# Altium schematic sheet NvideaJetsonUSBPage2.SchDoc
size A3
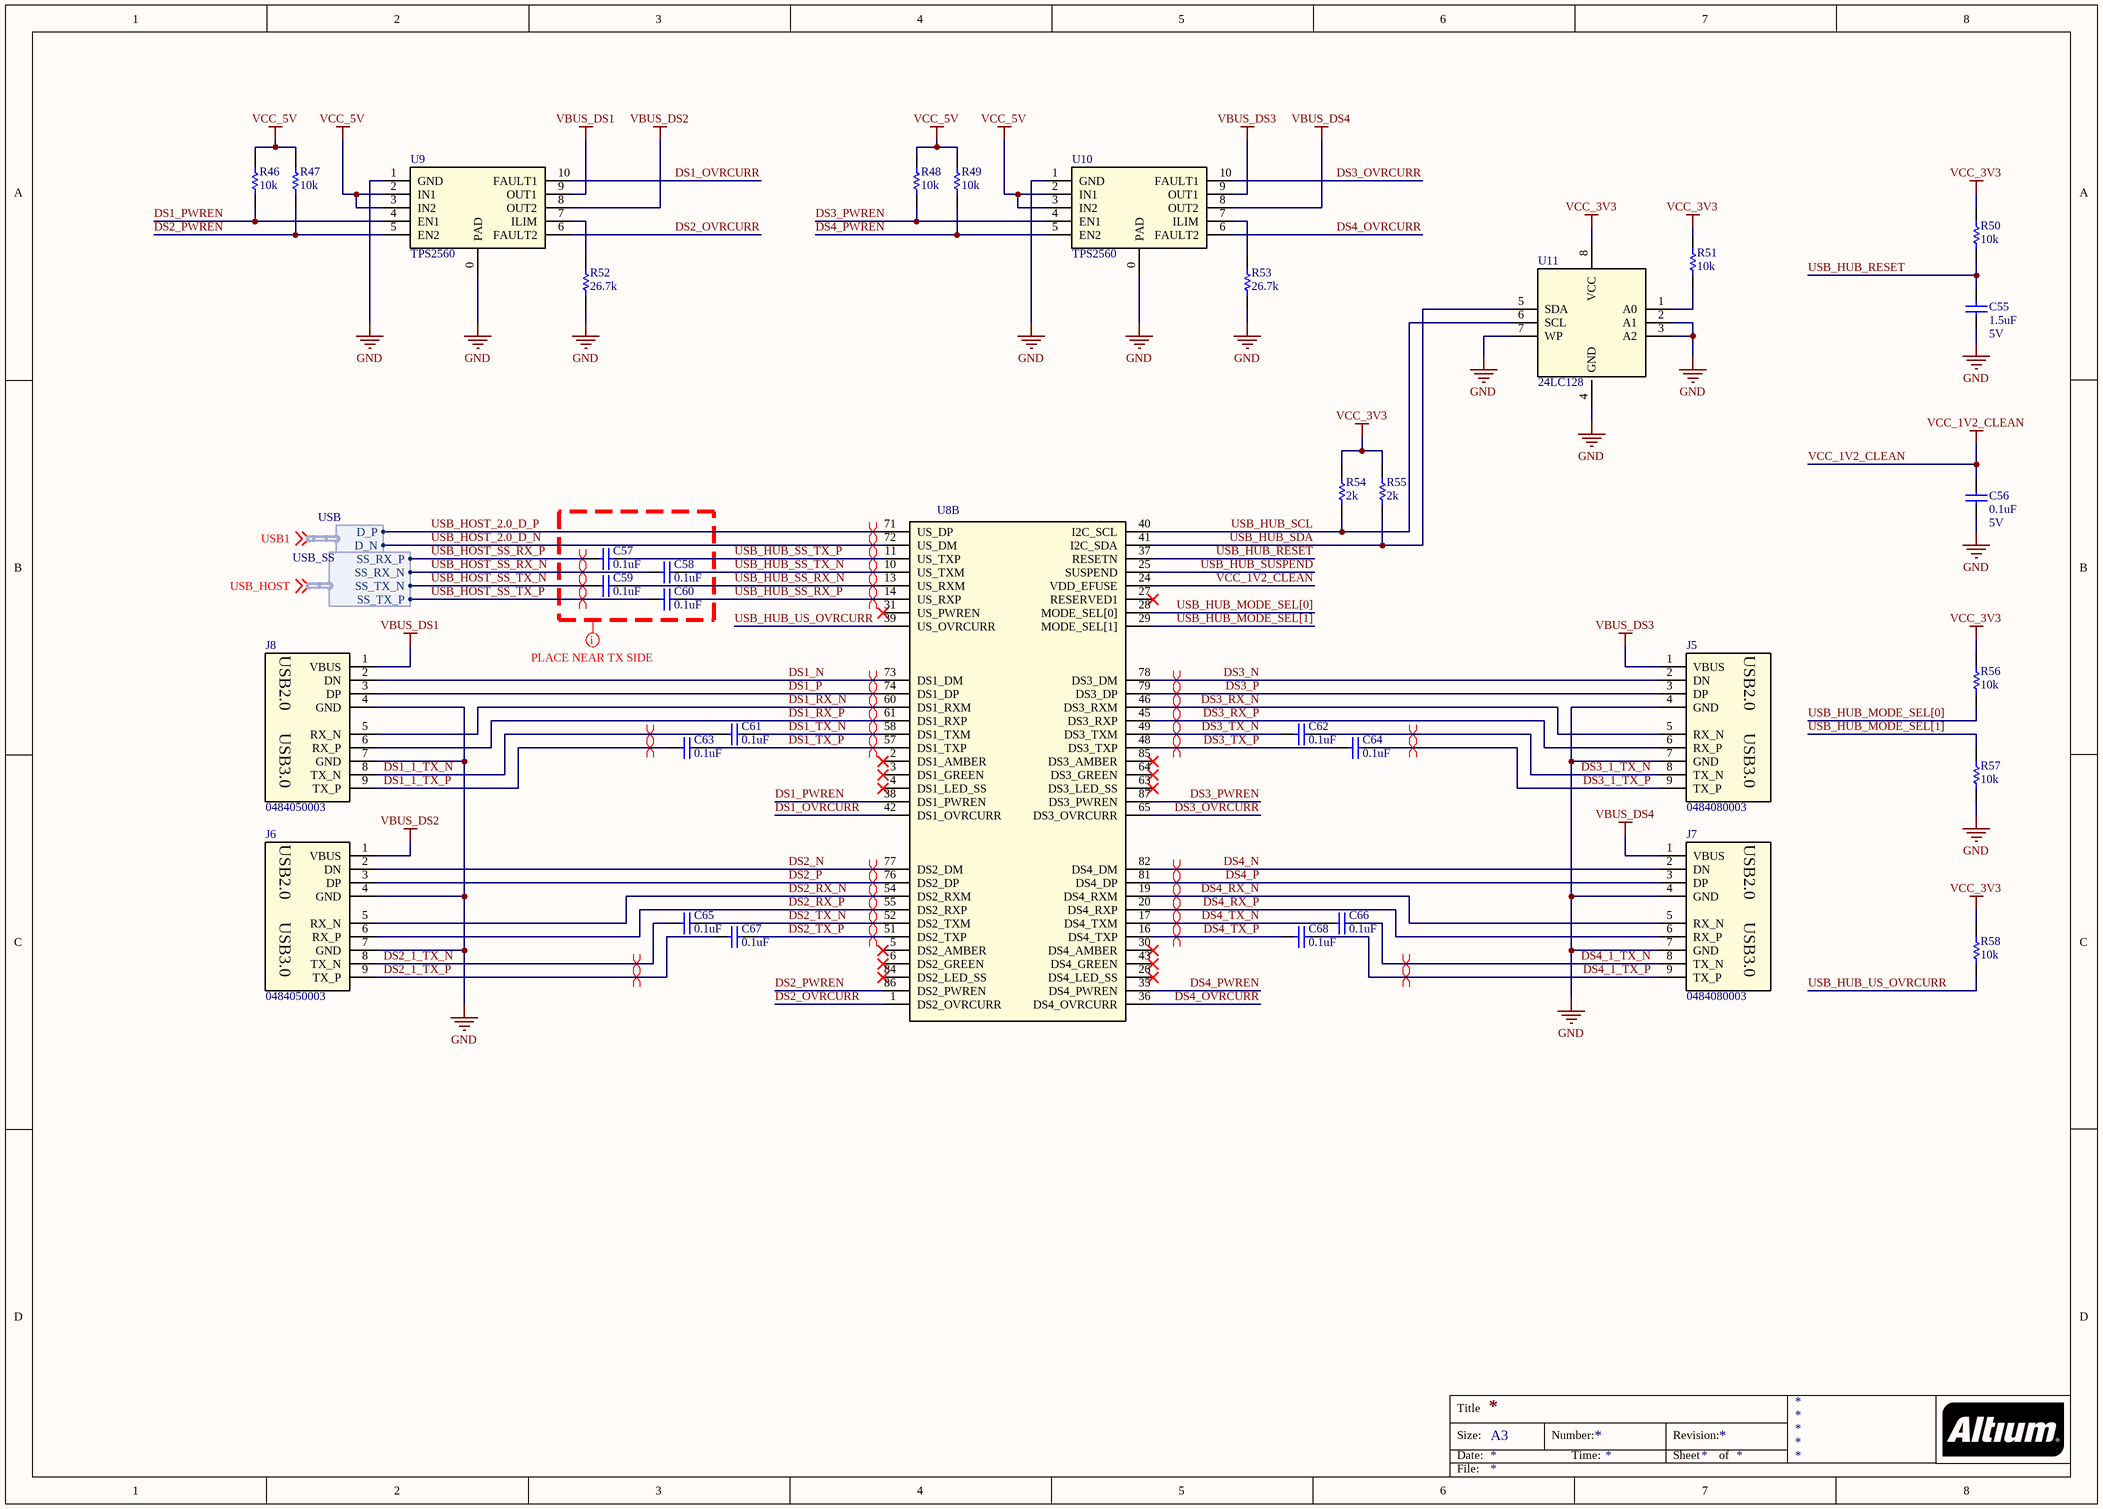
[diagram p0: NvideaJetsonUSBPage2.SchDoc]

## Parts
C55  value 1.5uF  Voltage: 5V  [C0402]  (hidden comment: CAP)
C56  value 0.1uF  Voltage: 5V  [C0402]  (hidden comment: CAP)
C57  value 0.1uF  [C0402]  (hidden comment: CAP)
C58  value 0.1uF  [C0402]  (hidden comment: CAP)
C59  value 0.1uF  [C0402]  (hidden comment: CAP)
C60  value 0.1uF  [C0402]  (hidden comment: CAP)
C61  value 0.1uF  [C0402]  (hidden comment: CAP)
C62  value 0.1uF  [C0402]  (hidden comment: CAP)
C63  value 0.1uF  [C0402]  (hidden comment: CAP)
C64  value 0.1uF  [C0402]  (hidden comment: CAP)
C65  value 0.1uF  [C0402]  (hidden comment: CAP)
C66  value 0.1uF  [C0402]  (hidden comment: CAP)
C67  value 0.1uF  [C0402]  (hidden comment: CAP)
C68  value 0.1uF  [C0402]  (hidden comment: CAP)
J5  0484080003  [0484080003]
J6  0484050003  [0484050003]
J7  0484080003  [0484080003]
J8  0484050003  [0484050003]
R46  value 10k  [R0402]  (hidden comment: RES)
R47  value 10k  [R0402]  (hidden comment: RES)
R48  value 10k  [R0402]  (hidden comment: RES)
R49  value 10k  [R0402]  (hidden comment: RES)
R50  value 10k  [R0402]  (hidden comment: RES)
R51  value 10k  [R0402]  (hidden comment: RES)
R52  value 26.7k  [R0402]  (hidden comment: RES)
R53  value 26.7k  [R0402]  (hidden comment: RES)
R54  value 2k  [R0402]  (hidden comment: RES)
R55  value 2k  [R0402]  (hidden comment: RES)
R56  value 10k  [R0402]  (hidden comment: RES)
R57  value 10k  [R0402]  (hidden comment: RES)
R58  value 10k  [R0402]  (hidden comment: RES)
U8  CYUSB3312-88LTXC  [QFN88]  (value not drawn)  (part B of 2)
U9  TPS2560  [VSON10]
U10  TPS2560  [VSON10]
U11  24LC128  [24LC128T-I/SN]

## Harnesses
USB_SS: SS_RX_P, SS_RX_N, SS_TX_N, SS_TX_P
USB: D_N, D_P

## Nets
GND: C55.2 C56.2 J5.4(GND) J5.7(GND) J6.4(GND) J6.7(GND) J7.4(GND) J7.7(GND) J8.4(GND) J8.7(GND) R52.2 R53.2 R57.2 U9.0(PAD) U9.1(GND) U10.0(PAD) U10.1(GND) U11.2(A1) U11.3(A2) U11.4(GND) U11.7(WP)
VBUS_DS1: J8.1(VBUS) U9.9(OUT1)
VBUS_DS2: J6.1(VBUS) U9.8(OUT2)
VBUS_DS3: J5.1(VBUS) U10.9(OUT1)
VBUS_DS4: J7.1(VBUS) U10.8(OUT2)
VCC_1V2_CLEAN: C56.1 U8.24(VDD_EFUSE)
VCC_3V3: R50.1 R51.1 R54.1 R55.1 R56.1 R58.1 U11.8(VCC)
VCC_5V: R46.1 R47.1 R48.1 R49.1 U9.2(IN1) U9.3(IN2) U10.2(IN1) U10.3(IN2)
DS1_1_TX_N: C61.1 J8.8(TX_N)
DS1_1_TX_P: C63.1 J8.9(TX_P)
DS1_N: J8.2(DN) U8.73(DS1_DM)
DS1_OVRCURR: U8.42(DS1_OVRCURR) U9.10(FAULT1)
DS1_P: J8.3(DP) U8.74(DS1_DP)
DS1_PWREN: R46.2 U8.38(DS1_PWREN) U9.4(EN1)
DS1_RX_N: J8.5(RX_N) U8.60(DS1_RXM)
DS1_RX_P: J8.6(RX_P) U8.61(DS1_RXP)
DS1_TX_N: C61.2 U8.58(DS1_TXM)
DS1_TX_P: C63.2 U8.57(DS1_TXP)
DS2_1_TX_N: C65.1 J6.8(TX_N)
DS2_1_TX_P: C67.1 J6.9(TX_P)
DS2_N: J6.2(DN) U8.77(DS2_DM)
DS2_OVRCURR: U8.1(DS2_OVRCURR) U9.6(FAULT2)
DS2_P: J6.3(DP) U8.76(DS2_DP)
DS2_PWREN: R47.2 U8.86(DS2_PWREN) U9.5(EN2)
DS2_RX_N: J6.5(RX_N) U8.54(DS2_RXM)
DS2_RX_P: J6.6(RX_P) U8.55(DS2_RXP)
DS2_TX_N: C65.2 U8.52(DS2_TXM)
DS2_TX_P: C67.2 U8.51(DS2_TXP)
DS3_1_TX_N: C62.2 J5.8(TX_N)
DS3_1_TX_P: C64.2 J5.9(TX_P)
DS3_N: J5.2(DN) U8.78(DS3_DM)
DS3_OVRCURR: U8.65(DS3_OVRCURR) U10.10(FAULT1)
DS3_P: J5.3(DP) U8.79(DS3_DP)
DS3_PWREN: R48.2 U8.87(DS3_PWREN) U10.4(EN1)
DS3_RX_N: J5.5(RX_N) U8.46(DS3_RXM)
DS3_RX_P: J5.6(RX_P) U8.45(DS3_RXP)
DS3_TX_N: C62.1 U8.49(DS3_TXM)
DS3_TX_P: C64.1 U8.48(DS3_TXP)
DS4_1_TX_N: C66.2 J7.8(TX_N)
DS4_1_TX_P: C68.2 J7.9(TX_P)
DS4_N: J7.2(DN) U8.82(DS4_DM)
DS4_OVRCURR: U8.36(DS4_OVRCURR) U10.6(FAULT2)
DS4_P: J7.3(DP) U8.81(DS4_DP)
DS4_PWREN: R49.2 U8.35(DS4_PWREN) U10.5(EN2)
DS4_RX_N: J7.5(RX_N) U8.19(DS4_RXM)
DS4_RX_P: J7.6(RX_P) U8.20(DS4_RXP)
DS4_TX_N: C66.1 U8.17(DS4_TXM)
DS4_TX_P: C68.1 U8.16(DS4_TXP)
USB_HOST_2.0_D_N: U8.72(US_DM) ; harness USB.D_N
USB_HOST_2.0_D_P: U8.71(US_DP) ; harness USB.D_P
USB_HOST_SS_RX_N: C58.1 ; harness USB_SS.SS_RX_N
USB_HOST_SS_RX_P: C57.1 ; harness USB_SS.SS_RX_P
USB_HOST_SS_TX_N: C59.1 ; harness USB_SS.SS_TX_N
USB_HOST_SS_TX_P: C60.1 ; harness USB_SS.SS_TX_P
USB_HUB_MODE_SEL[0]: R56.2 U8.28(MODE_SEL[0])
USB_HUB_MODE_SEL[1]: R57.1 U8.29(MODE_SEL[1])
USB_HUB_RESET: C55.1 R50.2 U8.37(RESETN)
USB_HUB_SCL: R54.2 U8.40(I2C_SCL) U11.6(SCL)
USB_HUB_SDA: R55.2 U8.41(I2C_SDA) U11.5(SDA)
USB_HUB_SS_RX_N: C59.2 U8.13(US_RXM)
USB_HUB_SS_RX_P: C60.2 U8.14(US_RXP)
USB_HUB_SS_TX_N: C58.2 U8.10(US_TXM)
USB_HUB_SS_TX_P: C57.2 U8.11(US_TXP)
USB_HUB_SUSPEND: U8.25(SUSPEND)
USB_HUB_US_OVRCURR: R58.2 U8.39(US_OVRCURR)
NetR51_2: R51.2 U11.1(A0)
NetR52_1: R52.1 U9.7(ILIM)
NetR53_1: R53.1 U10.7(ILIM)

Not connected (* = marked no-connect by the designer): U8 2(DS1_AMBER)* 3(DS1_GREEN)* 4(DS1_LED_SS)* 5(DS2_AMBER)* 6(DS2_GREEN)* 26(DS4_LED_SS)* 27(RESERVED1)* 30(DS4_AMBER)* 31(US_PWREN)* 43(DS4_GREEN)* 63(DS3_LED_SS)* 64(DS3_GREEN)* 84(DS2_LED_SS)* 85(DS3_AMBER)*

## Layout directives
mark named PLACE NEAR TX SIDE: (no net found under the mark)
differential pair; differential pair class DIFF; net class USB: DS1_1_TX_N, DS1_1_TX_P, DS1_N, DS1_P, DS1_RX_N, DS1_RX_P, DS1_TX_N, DS1_TX_P, DS2_1_TX_N, DS2_1_TX_P, DS2_N, DS2_P, DS2_RX_N, DS2_RX_P, DS2_TX_N, DS2_TX_P, DS3_1_TX_N, DS3_1_TX_P, DS3_N, DS3_P, DS3_RX_N, DS3_RX_P, DS3_TX_N, DS3_TX_P, DS4_1_TX_N, DS4_1_TX_P, DS4_N, DS4_P, DS4_RX_N, DS4_RX_P, DS4_TX_N, DS4_TX_P, USB_HOST_2.0_D_N, USB_HOST_2.0_D_P, USB_HOST_SS_RX_N, USB_HOST_SS_RX_P, USB_HOST_SS_TX_N, USB_HOST_SS_TX_P, USB_HUB_SS_RX_N, USB_HUB_SS_RX_P, USB_HUB_SS_TX_N, USB_HUB_SS_TX_P

## Notes on the sheet
- Labels drawn without touching a wire or pin: USB1, USB_HOST
- Title
- Size:
- Date:
- A3
- Number:
- Time:
- Revision:
- Sheet
- of
- File:
- (in symbol 0484050003) USB2.0; USB3.0
- (in symbol 0484080003) USB2.0; USB3.0

## Library data of the parts
C55-C68 = CAP: =Description
J5 J7 = 0484080003: USB3.0 Recepticle Vertical
J6 J8 = 0484050003: USB3.0 Recepticle Right Angle
R46-R58 = RES: =Description
U8 = CYUSB3312-88LTXC: USB3.0 Hub; Centerline_Pitch: .5 mm[.0197 in]; MP: 2309411-2; Number_of_Positions: 260; MF: TE Connectivity; Product_Type: Socket; SnapEDA_Link: https://www.snapeda.com/parts/2309411-2/TE%20Connectivity/view-part/?ref=snap; TE_purchase_URL: https://www.te.com/usa-en/product-2309411-2.html?te_bu=Cor&te_type=disp&te_campaign=seda_glo_cor-seda-global-disp-prtnr-fy19-seda-model-bom-cta_sma-317_1&elqCampaignId=32493; Package: None; EU_RoHS_Compliance: Compliant; Price: None; Value: *
U9 U10 = TPS2560: IC PWR SWITCH N-CHAN 1:2 10VSON
U11 = 24LC128: IC EEPROM 128K I2C 400KHZ